# Altium schematic sheet Receive_Station_Sch.SchDoc
size A; SheetNumber: 1; SheetTotal: 1
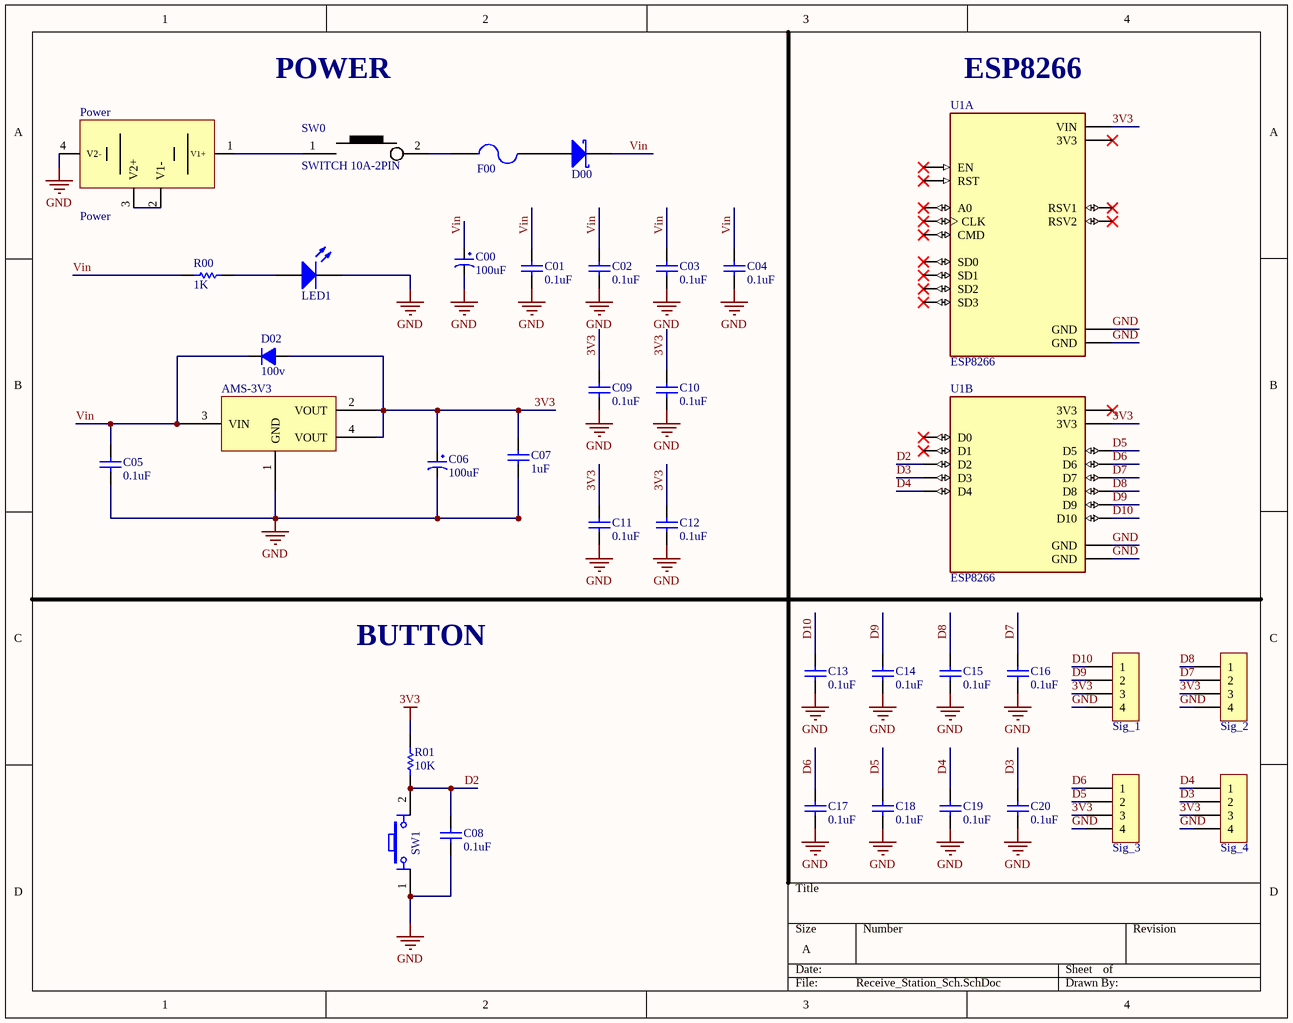
[diagram p0: Receive_Station_Sch.SchDoc]

## Parts
AMS-3V3  AMS1117-3.3V  [SOT223]  (value not drawn)
C00  100uF  [tu tantalum smd3528]
C01  value 0.1uF  [CAP-SM-0603]  (hidden comment: Cap Non-Pol SMD)
C02  value 0.1uF  [CAP-SM-0603]  (hidden comment: Cap Non-Pol SMD)
C03  value 0.1uF  [CAP-SM-0603]  (hidden comment: Cap Non-Pol SMD)
C04  value 0.1uF  [CAP-SM-0603]  (hidden comment: Cap Non-Pol SMD)
C05  value 0.1uF  [CAP-SM-0603]  (hidden comment: Cap Non-Pol SMD)
C06  100uF  [tu tantalum smd3528]
C07  value 1uF  [CAP-SM-0603]  (hidden comment: Cap Non-Pol SMD)
C08  value 0.1uF  [CAP-SM-0603]  (hidden comment: Cap Non-Pol SMD)
C09  value 0.1uF  [CAP-SM-0603]  (hidden comment: Cap Non-Pol SMD)
C10  value 0.1uF  [CAP-SM-0603]  (hidden comment: Cap Non-Pol SMD)
C11  value 0.1uF  [CAP-SM-0603]  (hidden comment: Cap Non-Pol SMD)
C12  value 0.1uF  [CAP-SM-0603]  (hidden comment: Cap Non-Pol SMD)
C13  value 0.1uF  [CAP-SM-0603]  (hidden comment: Cap Non-Pol SMD)
C14  value 0.1uF  [CAP-SM-0603]  (hidden comment: Cap Non-Pol SMD)
C15  value 0.1uF  [CAP-SM-0603]  (hidden comment: Cap Non-Pol SMD)
C16  value 0.1uF  [CAP-SM-0603]  (hidden comment: Cap Non-Pol SMD)
C17  value 0.1uF  [CAP-SM-0603]  (hidden comment: Cap Non-Pol SMD)
C18  value 0.1uF  [CAP-SM-0603]  (hidden comment: Cap Non-Pol SMD)
C19  value 0.1uF  [CAP-SM-0603]  (hidden comment: Cap Non-Pol SMD)
C20  value 0.1uF  [CAP-SM-0603]  (hidden comment: Cap Non-Pol SMD)
D00  D Schottky  [SS34]  (value not drawn)
D02  100v  [DIODE SMA]
F00  Fuse  [FUSE SMD]  (value not drawn)
H1  Sig_1  [XH2.54M-4]
H2  Sig_2  [XH2.54M-4]
H3  Sig_3  [XH2.54M-4]
H4  Sig_4  [XH2.54M-4]
LED1  LED SMD  [LED-5MM-WHITE]  (value not drawn)
Power  Power  [18650x2]
R00  value 1K  [RES-SM-0603]  (hidden comment: RESISTOR SMD)
R01  value 10K  [RES-SM-0603]  (hidden comment: RESISTOR SMD)
SW0  SWITCH 10A-2PIN  [SW_2ARS_TH]
SW1  Nut Nhan 4 Chan Cam 6x6  [Nut Nhan 4 Chan Cam 6x6]  (value not drawn)
U1  ESP8266  [SEEED_113990105]  (parts A,B of 2)

## Nets
3V3: AMS-3V3.2(VOUT) AMS-3V3.4(VOUT) C06.1 C07.2 C09.2 C10.2 C11.2 C12.2 D02.1(A) H1.3 H2.3 H3.3 H4.3 R01.2 U1.J1_15(VIN) U1.J2_15(3V3)
GND: AMS-3V3.1(GND) C00.2 C01.1 C02.1 C03.1 C04.1 C05.1 C06.2 C07.1 C08.1 C09.1 C10.1 C11.1 C12.1 C13.1 C14.1 C15.1 C16.1 C17.1 C18.1 C19.1 C20.1 H1.4 H2.4 H3.4 H4.4 LED1.2(K) Power.4(V2-) SW1.1 U1.J1_10(GND) U1.J1_14(GND) U1.J2_7(GND) U1.J2_14(GND)
D2: C08.2 R01.1 SW1.2 U1.J2_3(D2)
D3: C20.2 H4.2 U1.J2_4(D3)
D4: C19.2 H4.1 U1.J2_5(D4)
D5: C18.2 H3.2 U1.J2_8(D5)
D6: C17.2 H3.1 U1.J2_9(D6)
D7: C16.2 H2.2 U1.J2_10(D7)
D8: C15.2 H2.1 U1.J2_11(D8)
D9: C14.2 H1.2 U1.J2_12(D9)
D10: C13.2 H1.1 U1.J2_13(D10)
Vin: AMS-3V3.3(VIN) C00.1 C01.2 C02.2 C03.2 C04.2 C05.2 D00.2(K) D02.2(K) R00.1
NetD00_1: D00.1(A) F00.2
NetF00_1: F00.1 SW0.2
NetLED1_1: LED1.1(A) R00.2
NetPower_1: Power.1(V1+) SW0.1
NetPower_2: Power.2(V1-) Power.3(V2+)

Not connected (* = marked no-connect by the designer): U1 J1_1(A0)* J1_2(RSV1)* J1_3(RSV2)* J1_4(SD3)* J1_5(SD2)* J1_6(SD1)* J1_7(CMD)* J1_8(SD0)* J1_9(CLK)* J1_11(3V3)* J1_12(EN)* J1_13(RST)* J2_1(D0)* J2_2(D1)* J2_6(3V3)*

## Notes on the sheet
- POWER
- (near U1) ESP8266
- BUTTON

## Library data of the parts
AMS-3V3 = AMS1117 SMD: Dán; Value: AMS1117-3.3V SOT223; Don_Vi: Con; Ma_Hang: MH000596; Ghi_Chu: *; Kieu_Chan: *; Chung_Loai: Dán
C00 C06 = Tu tantalum 100uF 10V SMD6032: Dán; Don_Vi: Con; So_Chan: 2; Ten_Linh_Kien: Tụ tantalum 107A-100uF 10V SMD6032; Ma_Hang: MH007594; Chung_Loai: Dán; Kieu_Chan: *
C01 C02 C03 C04 C05 C07 C08 C09-C20 = Cap Non-Pol SMD: Capacitor
D00 = D Schottky: Schottky Diode; Published: 8-Jun-2000; LatestRevisionDate: 17-Jul-2002; LatestRevisionNote: Re-released for DXP Platform.; PackageReference: SMB; Publisher: Altium Limited; PackageDescription: DO-214-AA/SMB; 2 C-Bend Leads; Body 5.3 x 3.6 mm, inc. leads (LxW); Code_JEDEC: DO-214-AA
D02 = Diode 1N4007: Cắm; Ten_Linh_Kien: Diode 1N4007 1A (DIP); Don_Vi: Con; Ma_Hang: MH001063; Ghi Chu: *; Kieu_Chan: *; Chung_Loai: Cắm
H1-H4 = Header 4P 2.54 Duc Thang: Cắm; Ten_Linh_Kien: Header 4P XH2.54-4P Đực Thẳng; Don_Vi: Con; Ma_Hang: MH001285; Chung_Loai: Cắm
LED1 = LED SMD: LED
Power = P?
R00 R01 = RESISTOR SMD: Resistor
SW0 = SW1_RS-471005264153-TH: Rocker Switch SPST 16A (AC), 10A (DC) 250V Panel Mount, Snap-In; Manufacturer: Würth Elektronik; Alternate Part Number-1: NA; Manufacturer Part Number: 471005264153; Case/Package: TH; Supplier-1: Würth Elektronik; Supplier Part Number-1: 471005264153
SW1 = Nut Nhan 4 Chan Cam 6x6: Nut Nhan 4 Chan 6x6mm; Ten: Nút Nhấn 4 Chân 6x6x5MM DIP; Ma_Hang: MH004584
U1 = 113990105: - ESP8266 Transceiver; 802.11 b/g (Wi-Fi, WiFi, WLAN) 2.4GHz Evaluation Board; MF: Seeed Technology Co., Ltd; Price: None; Availability: In Stock; MP: 113990105; Package: None; SnapEDA_Link: https://www.snapeda.com/parts/113990105/Seeed+Technology+Co.%252C+Ltd/view-part/?ref=snap; Check_prices: https://www.snapeda.com/parts/113990105/Seeed+Technology+Co.%252C+Ltd/view-part/?ref=eda; Value: *; Purchase-URL: https://pricing.snapeda.com/search/part/113990105/?ref=eda